# EAGLE design Sensor_Platform+GPIO_3v_boost_v2_1 (EAGLE 7.4.0)
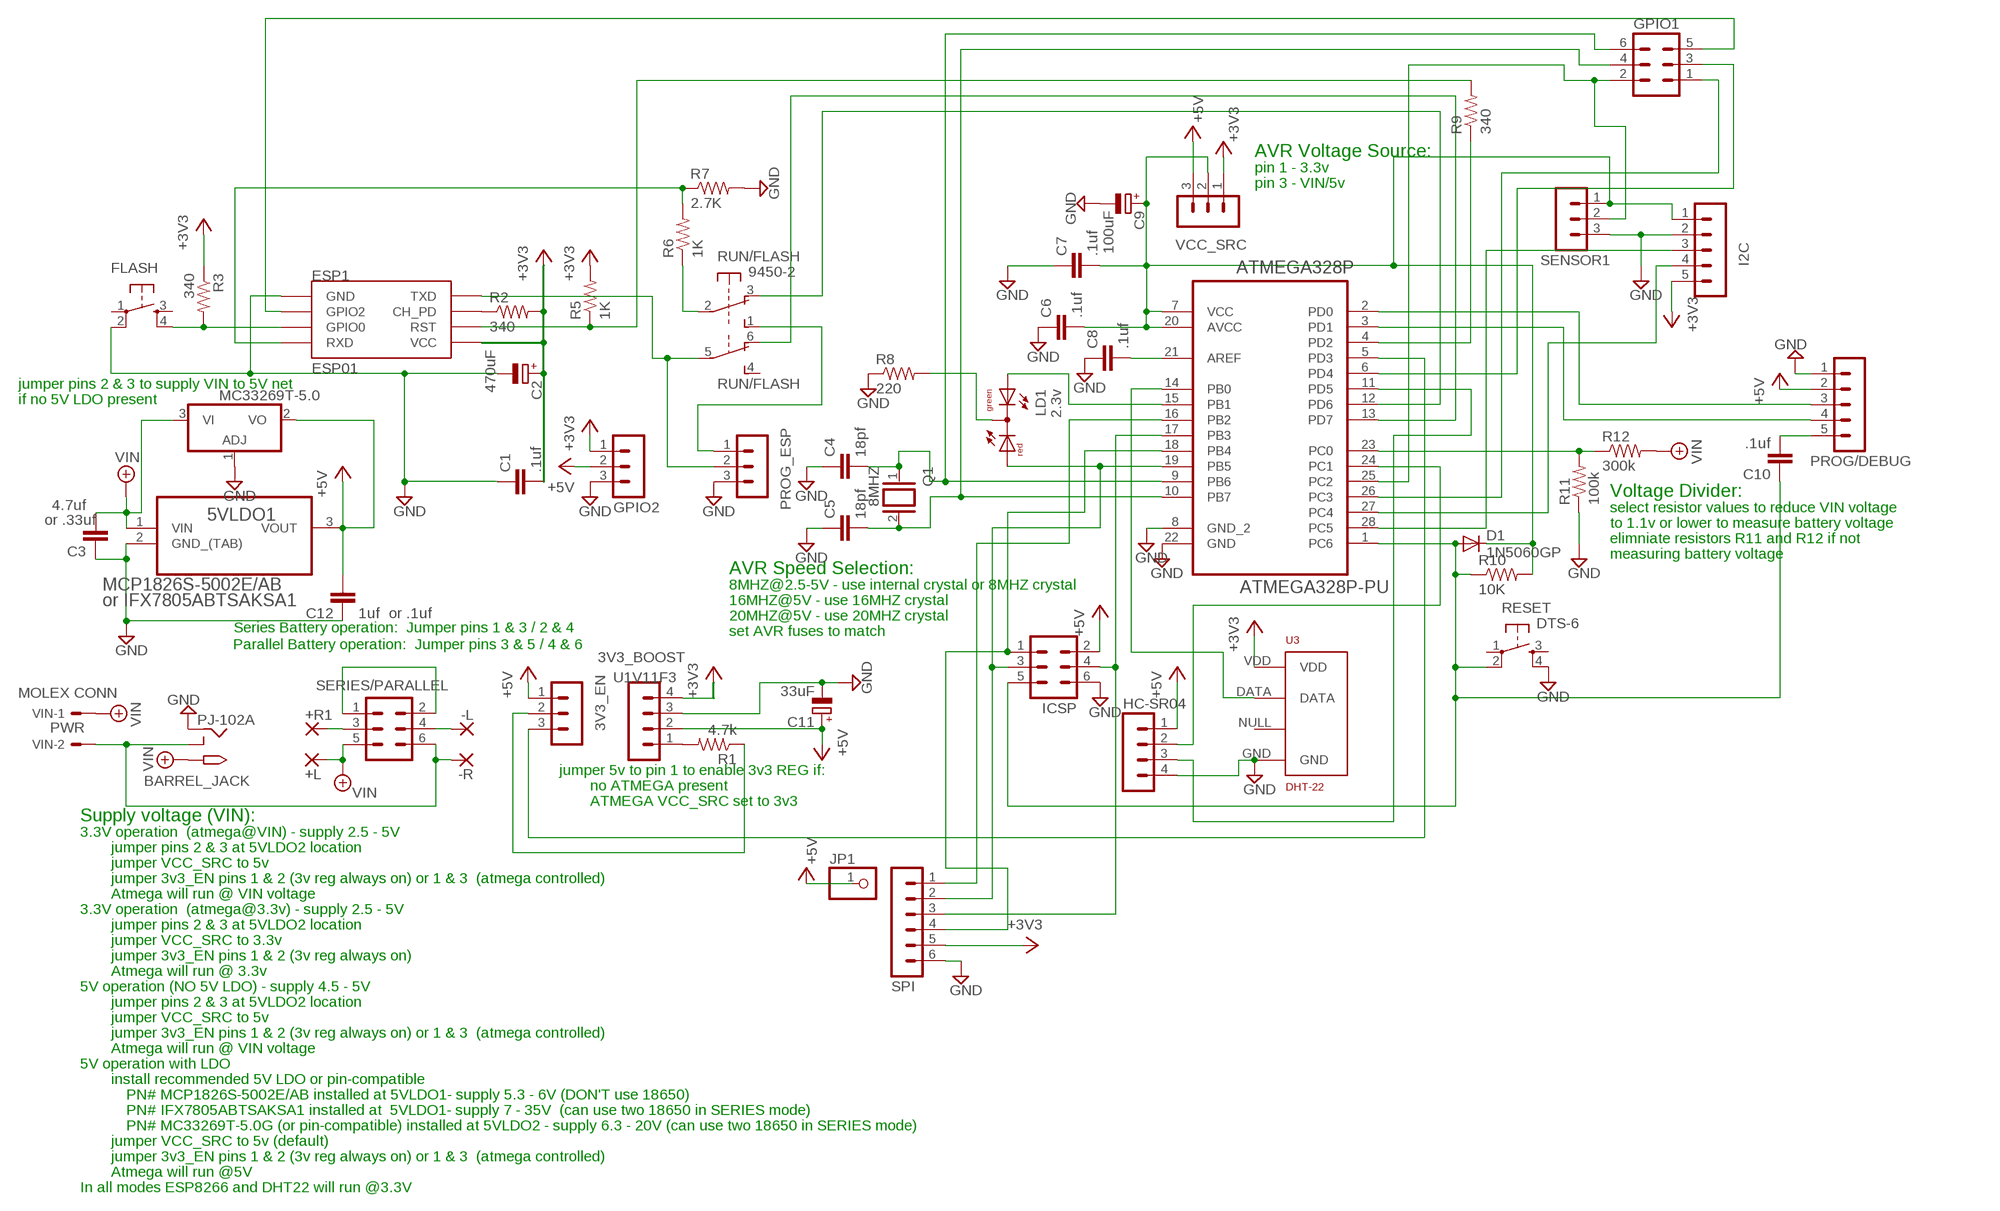
[diagram p0: schematic, sheet 1]

## Parts
3V3_BOOST  U1V11F3  MA04-1  [MA04-1]
3V3_EN  MA03-1  [MA03-1]
5VLDO1  MCP1826S-5002E/AB  [TO254P482X1024X3124-3P]
5VLDO2  MC33269T-5.0  [TO220V]
+L  WIREPADSMD2,54-5,08  [SMD2,54-5,08]
+R1  WIREPADSMD2,54-5,08  [SMD2,54-5,08]
-L  WIREPADSMD2,54-5,08  [SMD2,54-5,08]
-R  WIREPADSMD2,54-5,08  [SMD2,54-5,08]
ATMEGA328P  ATMEGA328P-PU  [DIP254P762X457-28]
BARREL_JACK  2.1MMJACKTHM  [PJ-102A]
C1  .1uf  C2.5/2  [C2.5-2]
C2  470uF  CPOL-EUE2,5-6E  [E2,5-6E]
C3  4.7uf  C2.5/2  [C2.5-2]
C4  18pf  C2.5/2  [C2.5-2]
C5  18pf  C2.5/2  [C2.5-2]
C6  .1uf  C2.5/2  [C2.5-2]
C7  .1uf  C2.5/2  [C2.5-2]
C8  .1uf  C2.5/2  [C2.5-2]
C9  100uF  CPOL-EUE2,5-6E  [E2,5-6E]
C10  .1uf  C2.5/2  [C2.5-2]
C11  33uF  CPOL-EUE2,5-6E  [E2,5-6E]
C12  1uf  C2.5/2  [C2.5-2]
D1  1N5060GP  [DO15-12]
ESP1  ESP01  [ESP01]
FLASH  DTS-6  [DTS-6]
GPIO1  MA03-2  [MA03-2]
GPIO2  MA03-1  [MA03-1]
HC-SR04  HC-SR04  MA04-1  [MA04-1]
I2C  MA05-1  [MA05-1]
ICSP  MA03-2  [MA03-2]
JP1  PINHD-1X1  [1X01]
LD1  2.3v  DUOLED-RG-C  [DUOLED-C-5MM]
PROG/DEBUG  MA05-1  [MA05-1]
PROG_ESP  MA03-1  [MA03-1]
Q1  8MHZ  XTAL/S  [QS]
R1  4.7k  R-US_0207/7  [0207/7]
R2  340  R-US_0207/7  [0207/7]
R3  340  R-US_0207/7  [0207/7]
R5  1K  R-US_0207/7  [0207/7]
R6  1K  R-US_0207/7  [0207/7]
R7  2.7K  R-US_0207/7  [0207/7]
R8  220  R-US_0207/7  [0207/7]
R9  340  R-US_0207/7  [0207/7]
R10  10K  R-US_0207/7  [0207/7]
R11  100k  R-US_0207/7  [0207/7]
R12  300k  R-US_0207/7  [0207/7]
RESET  DTS-6  [DTS-6]
RUN/FLASH  9450-2  [9450-2]
SENSOR1  MA03-1  [MA03-1]
SERIES/PARALLEL  MA03-2  [MA03-2]
SPI  MA06-1  [MA06-1]
U3  DHT-22  RHT03_DHT-22_AM2302  [RHT03_DHT-22]
VCC_SRC  MA03-1  [MA03-1]
VIN  PWR  22-27-2021-02  [6410-02]

## Nets
+3V3: 3V3_BOOST.4 C1.2 C2.+ ESP1.VCC GPIO2.1 I2C.5 R2.2 R3.1 R5.2 SPI.5 U3.VDD VCC_SRC.1
+4.1V: 5VLDO1.1(VIN) 5VLDO2.3(VI) +L.1(P) BARREL_JACK.TIP C3.2 R12.2 SERIES/PARALLEL.5 VIN.1 ; supply symbol labelled VIN
+5V: 3V3_BOOST.2 3V3_EN.1 5VLDO1.3(VOUT) 5VLDO2.2(VO) C11.+ C12.2 GPIO2.2 HC-SR04.1 ICSP.2 JP1.1 PROG/DEBUG.2 VCC_SRC.3
GND: 3V3_BOOST.3 5VLDO1.2(GND_(TAB)) 5VLDO2.1(ADJ) ATMEGA328P.8(GND_2) ATMEGA328P.22(GND) BARREL_JACK.RING C1.1 C2.- C3.1 C4.1 C5.1 C6.1 C7.1 C8.1 C9.- C11.- C12.1 ESP1.GND FLASH.2 GPIO2.3 HC-SR04.4 I2C.2 ICSP.6 PROG/DEBUG.1 PROG_ESP.3 R7.2 R8.1 R11.1 RESET.4 SENSOR1.3 SPI.6 U3.GND
N$1: ATMEGA328P.23(PC0) R11.2 R12.1
N$3: ESP1.GPIO0 FLASH.4 R3.2
N$4: ATMEGA328P.26(PC3) GPIO1.1
N$5: ESP1.RST R5.1 R9.2
N$6: ATMEGA328P.4(PD2) R9.1
N$7: 3V3_BOOST.1 R1.2
N$8: ESP1.GPIO2 GPIO1.5
N$9: ATMEGA328P.15(PB1) LD1.AX(AG)
N$10: ATMEGA328P.19(PB5) ICSP.3 LD1.AR SPI.2
N$11: ATMEGA328P.6(PD4) GPIO1.3
N$12: ATMEGA328P.7(VCC) ATMEGA328P.20(AVCC) C6.2 C7.2 C9.+ D1.C I2C.1 R10.2 SENSOR1.1 VCC_SRC.2
N$13: ATMEGA328P.12(PD6) RUN/FLASH.3(1:O)
N$14: ATMEGA328P.13(PD7) RUN/FLASH.6(2:O)
N$15: ATMEGA328P.21(AREF) C8.2
N$16: ESP1.RX(RXD) R6.2 R7.1
N$17: ESP1.TX(TXD) PROG_ESP.2 RUN/FLASH.5(2:P)
N$18: ATMEGA328P.2(PD0) PROG/DEBUG.3
N$19: ATMEGA328P.3(PD1) PROG/DEBUG.4
N$20: 3V3_EN.3 ATMEGA328P.5(PD3)
N$21: C10.2 PROG/DEBUG.5
N$22: ESP1.CH_PD R2.1
N$23: ATMEGA328P.17(PB3) ICSP.4 SPI.3
N$24: ATMEGA328P.14(PB0) U3.DATA
N$25: ATMEGA328P.18(PB4) ICSP.1 SPI.4
N$26: ATMEGA328P.9(PB6) C4.2 GPIO1.6 Q1.1
N$27: ATMEGA328P.10(PB7) C5.2 GPIO1.4 Q1.2
N$28: R6.1 RUN/FLASH.2(1:P)
N$29: ATMEGA328P.1(PC6) C10.1 D1.A ICSP.5 R10.1 RESET.2
N$30: LD1.C R8.2
N$31: 3V3_EN.2 R1.1
N$32: ATMEGA328P.28(PC5) I2C.3
N$33: PROG_ESP.1 RUN/FLASH.1(1:S)
N$34: ATMEGA328P.27(PC4) I2C.4
N$35: ATMEGA328P.25(PC2) GPIO1.2 SENSOR1.2
N$36: +R1.1(P) SERIES/PARALLEL.3
N$37: -R.1(P) BARREL_JACK.RING_SW SERIES/PARALLEL.6 VIN.2
N$38: -L.1(P) SERIES/PARALLEL.4
N$39: SERIES/PARALLEL.1 SERIES/PARALLEL.2
N$40: ATMEGA328P.11(PD5) HC-SR04.3
N$41: ATMEGA328P.24(PC1) HC-SR04.2
N$42: ATMEGA328P.16(PB2) SPI.1
Unconnected: FLASH.1 FLASH.3 RESET.1 RESET.3 RUN/FLASH.4(2:S) U3.NULL

## Notes on the sheet
- AVR Voltage Source:
- pin 1 - 3.3v
- pin 3 - VIN/5v
- jumper pins 2 & 3 to supply VIN to 5V net
- if no 5V LDO present
- Voltage Divider:
- select resistor values to reduce VIN voltage
- or .33uf | to 1.1v or lower to measure battery voltage
- elimniate resistors R11 and R12 if not
- measuring battery voltage
- AVR Speed Selection:
- 8MHZ@2.5-5V - use internal crystal or 8MHZ crystal
- or IFX7805ABTSAKSA1 | 16MHZ@5V - use 16MHZ crystal
- or .1uf | 20MHZ@5V - use 20MHZ crystal
- Series Battery operation:  Jumper pins 1 & 3 / 2 & 4 | set AVR fuses to match
- Parallel Battery operation:  Jumper pins 3 & 5 / 4 & 6
- MOLEX CONN
- PJ-102A
- jumper 5v to pin 1 to enable 3v3 REG if:
- no ATMEGA present
- ATMEGA VCC_SRC set to 3v3
- Supply voltage (VIN):
- 3.3V operation  (atmega@VIN) - supply 2.5 - 5V
- jumper pins 2 & 3 at 5VLDO2 location
- jumper VCC_SRC to 5v
- jumper 3v3_EN pins 1 & 2 (3v reg always on) or 1 & 3  (atmega controlled)
- Atmega will run @ VIN voltage
- 3.3V operation  (atmega@3.3v) - supply 2.5 - 5V
- jumper pins 2 & 3 at 5VLDO2 location
- jumper VCC_SRC to 3.3v
- jumper 3v3_EN pins 1 & 2 (3v reg always on)
- Atmega will run @ 3.3v
- 5V operation (NO 5V LDO) - supply 4.5 - 5V
- jumper pins 2 & 3 at 5VLDO2 location
- jumper VCC_SRC to 5v
- jumper 3v3_EN pins 1 & 2 (3v reg always on) or 1 & 3  (atmega controlled)
- Atmega will run @ VIN voltage
- 5V operation with LDO
- install recommended 5V LDO or pin-compatible
- PN# MCP1826S-5002E/AB installed at 5VLDO1- supply 5.3 - 6V (DON'T use 18650)
- PN# IFX7805ABTSAKSA1 installed at  5VLDO1- supply 7 - 35V  (can use two 18650 in SERIES mode)
- PN# MC33269T-5.0G (or pin-compatible) installed at 5VLDO2 - supply 6.3 - 20V (can use two 18650 in SERIES mode)
- jumper VCC_SRC to 5v (default)
- jumper 3v3_EN pins 1 & 2 (3v reg always on) or 1 & 3  (atmega controlled)
- Atmega will run @5V
- In all modes ESP8266 and DHT22 will run @3.3V

## Library data of the parts
3V3_BOOST HC-SR04 = con-lstb:MA04-1: PIN HEADER; OC_FARNELL: unknown; OC_NEWARK: unknown
3V3_EN GPIO2 PROG_ESP SENSOR1 VCC_SRC = con-lstb:MA03-1: PIN HEADER; OC_FARNELL: unknown; OC_NEWARK: unknown
5VLDO1 = Microchip_By_element14_Batch_1:MCP1826S-5002E/AB: IC, LDO, 5.0V, 1A; MPN: MCP1826S-5002E/AB; OC_FARNELL: 1578425; OC_NEWARK: 08N6494; PACKAGE: TO-220-3; SUPPLIER: Microchip
5VLDO2 = linear:MC33269?*: Adjustable Output Low Dropout Voltage Regulator 800 mA Source: http://www.onsemi.com/pub/Collateral/MC33269-D.PDF
+L +R1 -L -R = wirepad:WIREPAD: Wire PAD connect wire on PCB
ATMEGA328P = Atmel_By_element14_Batch_1-00:ATMEGA328P-PU: 8-bit Microcontroller with In-System Programmable Flash; MPN: ATMEGA328P-PU; OC_FARNELL: 1715487; OC_NEWARK: 15R0268; PACKAGE: PDIP-28; SUPPLIER: Atmel
BARREL_JACK = adafruit:2.1MMJACK: 2.1mm x 5.5mm THM DC jack with internal switch. Digikey part #PJ-102A, 4UCON part #05537 2.1mm x 5.5mm SMT DC jack with internal switch. Digikey part #PJ-002A-SMT, 4UCON part #03267 By microbuilder.eu & adafruit.com
C1 C3-C8 C10 C12 = capacitor-wima:C: CAPACITOR naming: grid - package width
C2 C9 C11 = rcl:CPOL-EU: POLARIZED CAPACITOR, European symbol
D1 = diode:1N5060GP: DIODE controlled avalanche rectifier
ESP1 = esp8266modules:ESP01: ESP8266 Wifi module 01
FLASH RESET = switch-tact:DTS-6
GPIO1 ICSP SERIES/PARALLEL = con-lstb:MA03-2: PIN HEADER; OC_FARNELL: unknown; OC_NEWARK: unknown
I2C PROG/DEBUG = con-lstb:MA05-1: PIN HEADER; OC_FARNELL: unknown; OC_NEWARK: unknown
JP1 = pinhead:PINHD-1X1: PIN HEADER
LD1 = led:DUOLED-RG-C: DUO LED 2 colors (red/green), 5 mm, round, common Cathode www.ligitek.com or other producers.
Q1 = special:XTAL/S: CRYSTAL
R1-R3 R5-R12 = rcl:R-US_: RESISTOR, American symbol
RUN/FLASH = switch-misc:9450-2: MARQUARDT SWITCH
SPI = con-lstb:MA06-1: PIN HEADER; OC_FARNELL: unknown; OC_NEWARK: unknown
U3 = RHT03_DHT-22_AM2302:RHT03_DHT-22_AM2302: RHT03 / DHT-22 / AM2302 Packages and symbol for the RHT03 / DHT-22 relative humidity and temperature sensor. Note: The AM2302 is a wired version of the DHT-22 which typically requires less clearance and is thus provided as a separate package.; PROD_ID: SEN-10167
VIN = con-molex:22-?-02: CONNECTOR wire to board 2.54 mm (.1 inch) pitch header; OC_FARNELL: unknown; OC_NEWARK: unknown

## Net classes
0 default: width 0.152 mm, drill 0.305 mm, clearance 0.152 mm
1 GND: width 0.305 mm, drill 0.305 mm, clearance 0.152 mm
2 +4.1V: width 0.305 mm, drill 0.305 mm, clearance 0.152 mm
3 +5V: width 0.305 mm, drill 0.305 mm, clearance 0.152 mm
4 +3V3: width 0.305 mm, drill 0.305 mm, clearance 0.152 mm

## Board
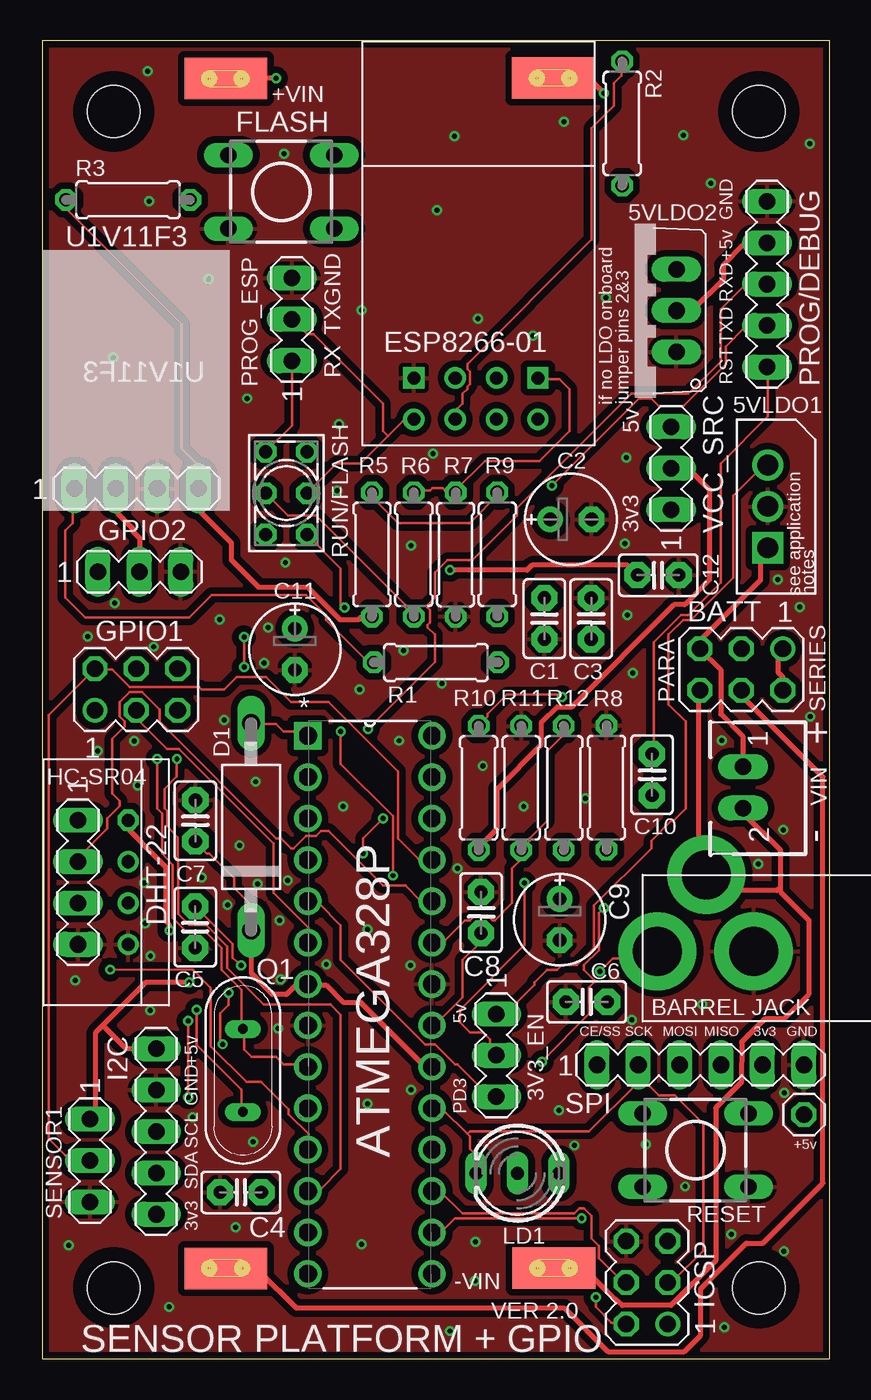
[diagram p1: board, top side]
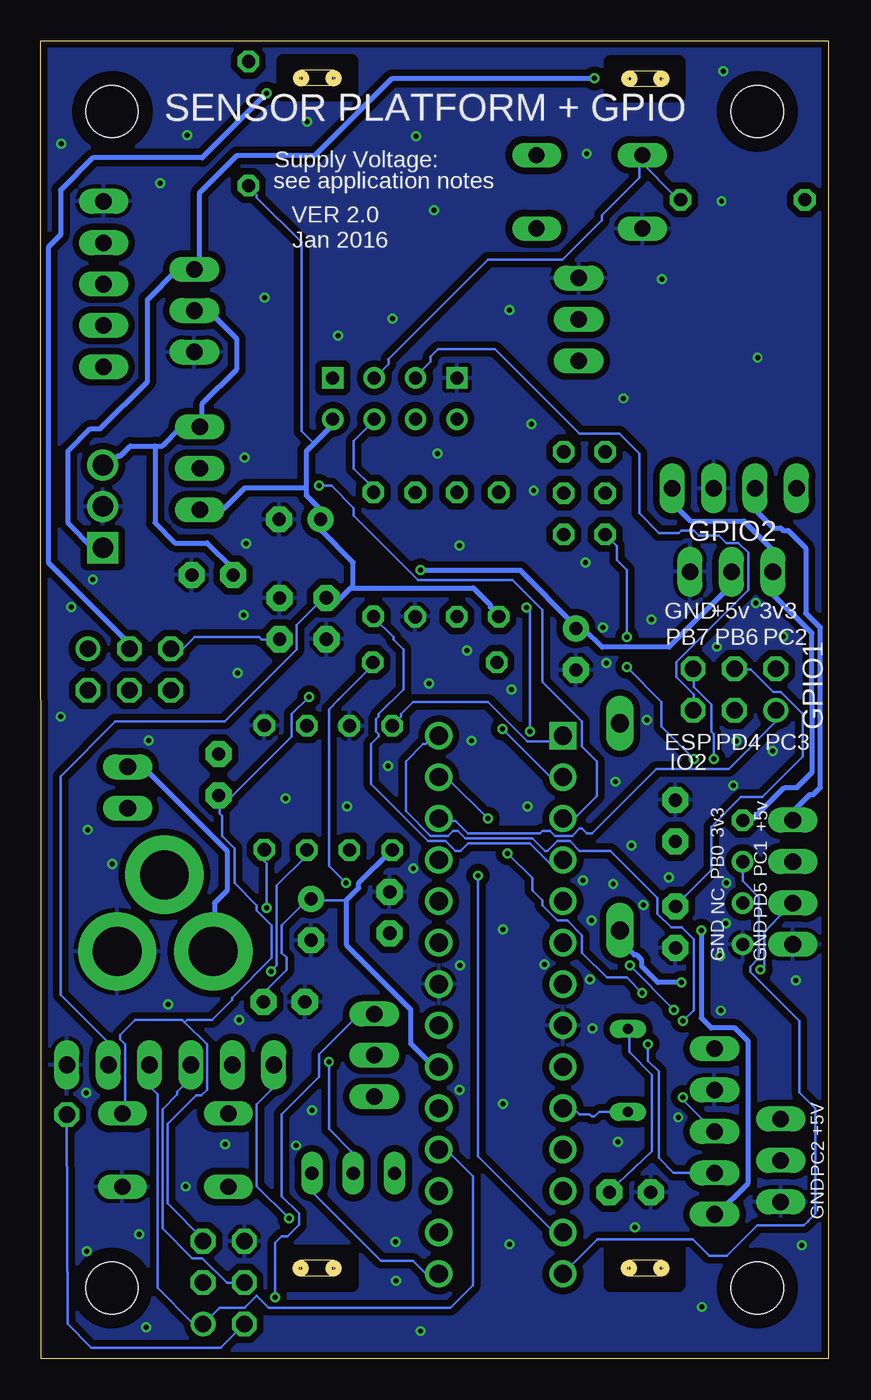
[diagram p2: board, bottom side, seen from below]

Size 48.34 x 80.87 mm. Coordinates in mm from the lower left corner, seen from the top.
Outline: 0,0 48.31,0 48.34,80.87 0,80.87 0,0
Copper layers (1*16): Top 0.035mm / dielectric 1.5mm / Bottom 0.035mm
Design rules "SeeedStudio_2layer_DRU_no_angle_20140221": minimum track width 6mil, minimum drill 12mil, track to track 6mil, track to pad 6mil, pad to pad 6mil, via to via 6mil, smd to smd 0mil, copper to edge 10mil, drill to drill 10mil, minimum pad ring 10mil, minimum via ring 6mil, stop-mask expansion 2mil, vias tented up to drill 100mil, thermal gap 10mil
Holes 3.2 mm at 43.97,4.34 4.37,76.53 43.97,76.53 4.37,4.34
tRestrict: area 2.5,74.7 to 6.2,78.4; area 42.1,74.7 to 45.8,78.4; area 42.1,2.5 to 45.8,6.2; area 2.5,2.5 to 6.2,6.2
bRestrict: area 2.5,74.7 to 6.2,78.4; area 42.1,74.7 to 45.8,78.4; area 29.3,77.6 to 33.5,79.7; area 42.1,2.5 to 45.8,6.2; area 2.5,2.5 to 6.2,6.2; area 9.2,77.5 to 13.4,79.6; area 9.2,4.5 to 13.4,6.6; area 29.2,4.5 to 33.5,6.6
Milling: area 10.2,5.1 to 12.2,6.1; area 30.4,5.1 to 32.4,6.1; area 30.4,78.1 to 32.4,79.1; area 10.2,78 to 12.2,79; area 9.9,78.2 to 10.5,78.8; area 11.9,78.2 to 12.5,78.8; area 30.1,78.3 to 30.6,78.9; area 32.1,78.3 to 32.6,78.9; area 32.1,5.3 to 32.7,5.8; area 30.1,5.3 to 30.7,5.8; area 9.9,5.3 to 10.5,5.8; area 12,5.3 to 12.5,5.8

### Footprints (pad centres in the part's own frame; a part is rotated, then mirrored left to right if it is on the bottom)
MA04-1 = drill 1.016 long: 1 -3.81,0; 2 -1.27,0; 3 1.27,0; 4 3.81,0
MA03-1 = drill 1.016 long: 1 -2.54,0; 2 0,0; 3 2.54,0
TO254P482X1024X3124-3P = drill 1.27 square: 1 -5.08,0.991 | drill 1.27: 2 -2.54,0.991; 3 0,0.991
TO220V = drill 1.016 long: 1 -2.54,-2.54; 2 0,-2.54; 3 2.54,-2.54
SMD2,54-5,08 = smd 2.54 x 5.08: 1 0,0
DIP254P762X457-28 = drill 1.118 square: 1 -7.62,33.02 | drill 1.118: 2 -7.62,30.48; 3 -7.62,27.94; 4 -7.62,25.4; 5 -7.62,22.86; 6 -7.62,20.32; 7 -7.62,17.78; 8 -7.62,15.24; 9 -7.62,12.7; 10 -7.62,10.16; 11 -7.62,7.62; 12 -7.62,5.08; 13 -7.62,2.54; 14 -7.62,0; 15 0,0; 16 0,2.54; 17 0,5.08; 18 0,7.62; 19 0,10.16; 20 0,12.7; 21 0,15.24; 22 0,17.78; 23 0,20.32; 24 0,22.86; 25 0,25.4; 26 0,27.94; 27 0,30.48; 28 0,33.02
PJ-102A = drill 3 pad 4.8: RING 0.1,-3.39; RING_SW -4.6,-6.29; TIP 0.1,-9.29
C2.5-2 = drill 0.813 pad 1.6 octagon: 1 -1.27,0; 2 1.27,0
E2,5-6E = drill 0.813 pad 1.575: + -1.27,0 | drill 0.813 pad 1.575 octagon: - 1.27,0
DO15-12 = drill 1.118 long: A 6.35,0; C -6.35,0
ESP01 = drill 0.8: CH_PD -1.285,-8.178; GPIO0 1.255,-5.638; GPIO2 -1.285,-5.638; RST 1.255,-8.178; TX -3.825,-8.178; VCC 3.795,-8.178 | drill 0.8 square: GND -3.825,-5.638; RX 3.795,-5.638
DTS-6 = drill 1 long: 1 -3.25,2.25; 2 3.25,2.25; 3 -3.25,-2.25; 4 3.25,-2.25
MA03-2 = drill 1.016: 1 -2.54,-1.27 | drill 1.016 octagon: 2 -2.54,1.27; 3 0,-1.27; 4 0,1.27; 5 2.54,-1.27; 6 2.54,1.27
MA05-1 = drill 1.016 long: 1 -5.08,0; 2 -2.54,0; 3 0,0; 4 2.54,0; 5 5.08,0
1X01 = drill 1.016 octagon: 1 0,0
DUOLED-C-5MM = drill 0.813 long: AR 2.54,0; AX -2.54,0; C 0,0
QS = drill 0.61 long: 1 -2.54,0; 2 2.54,0
0207/7 = drill 0.813 octagon: 1 -3.81,0; 2 3.81,0
9450-2 = drill 0.813 octagon: 1 -2.54,-1.27; 2 0,-1.27; 3 2.54,-1.27; 4 -2.54,1.27; 5 0,1.27; 6 2.54,1.27
MA06-1 = drill 1.016 long: 1 -6.35,0; 2 -3.81,0; 3 -1.27,0; 4 1.27,0; 5 3.81,0; 6 6.35,0
RHT03_DHT-22 = drill 0.8: DATA -1.27,0; GND 3.81,0; NULL 1.27,0 | drill 0.8 octagon: VDD -3.81,0
6410-02 = drill 1.016 long: 1 1.27,0.914; 2 -1.27,0.914

### Placement (x,y rotation side)
3V3_BOOST  5.77,53.41 0 top
3V3_EN  27.86,18.62 270 top
5VLDO1  45.52,54.84 90 top
5VLDO2  36.37,64.31 90 top
+L  11.26,78.57 270 top
+R1  31.34,78.59 90 top
-L  11.25,5.54 90 top
-R  31.39,5.56 90 top
ATMEGA328P  23.91,5.21 0 top
BARREL_JACK  47.04,25.1 270 top
C1  30.81,45.42 90 top
C2  32.44,51.5 0 top
C3  33.68,45.42 270 top
C4  12.17,10.21 0 top
C5  9.38,26.48 90 top
C6  33.4,21.89 0 top
C7  9.39,33.01 270 top
C8  26.92,27.38 270 top
C9  31.75,26.95 270 top
C10  37.41,35.84 90 top
C11  15.49,43.54 270 top
C12  37.79,48.08 180 top
D1  12.8,32.64 90 top
ESP1  26.62,65.82 0 top
FLASH  14.66,71.61 180 top
GPIO1  5.76,41.06 0 top
GPIO2  5.95,48.29 0 top
HC-SR04  2.18,29.24 270 top
I2C  6.98,13.94 270 top
ICSP  37.11,4.67 90 top
JP1  46.73,14.99 0 top
LD1  29.16,11.38 180 top
PROG/DEBUG  44.48,65.94 270 top
PROG_ESP  15.32,63.78 90 top
Q1  12.3,17.69 270 top
R1  24.15,42.72 180 top
R2  35.58,75.79 270 top
R3  5.26,71.12 0 top
R5  20.23,49.35 270 top
R6  22.8,49.35 90 top
R7  25.35,49.34 270 top
R8  34.62,35.05 270 top
R9  27.92,49.36 90 top
R10  26.77,35.03 270 top
R11  29.39,35.03 270 top
R12  32,35.03 270 top
RESET  40.08,12.8 0 top
RUN/FLASH  14.97,53.12 270 top
SENSOR1  2.92,12.17 270 top
SERIES/PARALLEL  42.9,42.29 180 top
SPI  40.39,18.03 0 top
U3  5.26,29.23 270 top
VCC_SRC  38.58,54.64 90 top
VIN  43.92,35.05 90 top

### Tracks (layer width: path | path; a pad name or v marks a point on that pad's centre or on a via)
+3V3  (via drill 0.3)
  Top 0.152: R3.1 1.55,71.09 1.55,70.49 8.56,63.47 8.56,55.85 9.47,54.94 9.47,53.42 3V3_BOOST.4 9.63,53.26 | 20.14,45.49 R5.2
  Top 0.305: v7.8,26.29 7.8,26.59 7.59,26.82 7.59,30.15 6.88,30.86 5.36,32.41 5.36,32.94 U3.VDD | 9.63,53.26 9.63,52.04 11.61,50.06 11.61,49 13.26,47.35 16.28,47.35 18.29,45.34 19.38,45.34 19.53,45.49 20.14,45.49
  Bottom 0.152: 3.38,48.23 GPIO2.1 3.53,48.39 | 9.47,53.26 3V3_BOOST.4 | 30.5,57.23 30.5,57.53 ESP1.VCC | 31.27,51.59 C2.+ 31.11,51.44 | 31.57,56.16 32.33,56.92 32.33,68.5 35.08,71.25 35.08,71.4 35.53,71.86 R2.2 | 38.58,52.2 VCC_SRC.1 | 30.66,46.56 C1.2 30.81,46.56 31.11,46.56 32.64,45.03 32.64,43.51 37.06,39.09 43.76,39.09 47.12,35.74 47.12,22.33 44.22,19.43 44.22,18.06 SPI.5
  Bottom 0.305: 3.38,48.23 3.38,46.86 1.02,44.53 0.99,35.99 1.93,35.05 2.69,35.05 4.6,33.15 5.21,33.15 U3.VDD | v7.8,26.29 7.8,20.9 7.19,20.29 5.74,20.29 4.93,19.48 4.93,10.77 6.83,8.86 | 9.47,52.5 9.47,53.26 | 3.53,48.39 3.53,49.76 5.18,51.41 8.46,51.41 9.47,52.43 | 30.5,57.23 31.57,56.16 32.03,55.7 32.03,53.42 | 32.03,53.42 32.03,52.96 31.27,52.2 31.27,51.59 | 38.58,52.2 37.06,52.2 35.84,53.42 32.03,53.42 | 29.16,47.29 29.31,47.29 30.05,46.56 30.66,46.56 | 29.16,47.29 21.79,47.29 20.75,46.25 20.75,46.1 20.29,45.64 R5.2 | 31.11,51.44 31.11,50.83 29.16,48.87 29.16,47.29
  Bottom 0.406: 9.47,52.5 9.47,52.43 | I2C.5 6.83,8.86
+4.1V  (via drill 0.3)
  Top 0.152: v34.21,23.77 35,24.56 37.32,24.56 BARREL_JACK.TIP | 40.41,43.66 SERIES/PARALLEL.5 | 11.3,78.56 +L.1
  Top 0.305: 40.41,43.66 40.41,44.12 44.07,47.78 44.07,49.3 5VLDO1.1 | VIN.1 43,38.18 41.63,39.55 41.63,42.29 SERIES/PARALLEL.5 | v14.35,78.56 11.3,78.56
  Bottom 0.152: v34.21,23.77 33.86,24.13 33.86,29.03 32.03,30.86 32.03,31.17 R12.2 | 39.04,66.83 5VLDO2.3 38.89,66.98 38.58,67.28 | C3.2 33.7,44.12 34.77,44.12 34.92,44.27 38.89,44.27 39.65,43.51 40.26,43.51 SERIES/PARALLEL.5 | 43,36.2 VIN.1 | 37.67,25.08 BARREL_JACK.TIP
  Bottom 0.305: 39.04,66.83 39.95,66.83 41.78,65 41.78,59.97 44.68,57.07 45.29,57.07 46.66,55.7 46.66,51.28 45.13,49.76 5VLDO1.1 | 38.58,67.28 38.58,71.55 36.3,73.84 31.5,73.84 26.77,78.56 v14.35,78.56 | 37.67,25.08 37.67,27.97 36.91,28.73 36.91,31.17 38.73,32.99 41.93,36.2 43,36.2
+5V  (via drill 0.3)
  Top 0.152: 4.6,51.89 4.6,53.26 3V3_BOOST.2 | 5.97,48.39 GPIO2.2 | v33.96,3.76 33.96,3.18 34.92,2.21 35.84,2.21 ICSP.2 | 39.04,64.39 5VLDO2.2 | 44.37,68.35 PROG/DEBUG.2 | 5VLDO1.3 44.53,54.79 44.22,54.79 42.39,52.96 42.39,47.93 39.8,45.34 39.34,45.34 38.43,44.42 38.43,40.16 39.5,39.09 39.5,33.76 38.73,32.99 38.58,32.99 37.36,31.78 37.36,31.32 33.86,27.81 33.86,25.22 32.79,24.16 31.88,24.16 31.57,23.85 30.96,23.85 30.2,23.09 30.2,22.94 29.03,21.77 28.47,21.77 3V3_EN.1 | 36.45,48.08 C12.2
  Top 0.305: 5.97,48.39 5.97,50.37 5.51,50.83 5.51,50.98 4.6,51.89 | 39.04,64.39 39.95,64.39 41.78,66.22 41.78,67.13 43,68.35 44.37,68.35 | v25.02,48.39 29.74,48.39 30.05,48.69 35.91,48.69 C12.2
  Bottom 0.152: 2.16,33.15 HC-SR04.1 | 4.44,53.26 3V3_BOOST.2 | 15.42,44.73 C11.+ 15.57,44.88 | 5.97,48.23 GPIO2.2 | 38.58,57.07 VCC_SRC.3 38.58,57.23 38.43,57.38 | 44.53,54.94 5VLDO1.3 | 36.6,48.08 C12.2 | JP1.1 46.68,2.13 45.24,0.69 37.29,0.69 ICSP.2 | v33.96,3.76 33.96,7.11 33.55,7.52 33.2,7.52 32.49,8.23 32.49,8.92 33.55,9.98 33.55,15.01 31.27,17.3 31.27,18.67 28.98,20.96 28.85,20.96 28.26,21.55 3V3_EN.1
  Bottom 0.305: 4.44,53.26 4.44,52.04 3.38,50.98 2.92,50.98 2.77,50.83 2.46,50.83 1.4,49.76 1.4,45.75 0.48,44.88 0.48,35.05 0.91,34.62 1.14,34.62 2.16,33.6 2.16,33.15 | 15.42,44.73 14.96,44.73 13.89,43.66 9.78,43.66 5.97,47.47 5.97,48.23 | 38.58,57.07 39.8,57.07 40.87,56.01 41.32,56.01 | 41.32,56.01 42.85,56.01 43.46,55.4 43.61,55.4 44.07,54.94 44.53,54.94 | 36.6,48.08 36.6,48.54 38.12,50.06 40.11,50.06 41.32,51.28 41.32,56.01 | 38.43,57.38 38.43,58.6 36.3,60.73 36.3,62.56 37.97,64.24 38.89,64.24 5VLDO2.2 | v25.02,48.39 18.92,48.39 15.57,45.03 15.57,44.88
GND  (via drill 0.3)
  other vias: 9.78,29.54 17.42,24.21 19.96,15.65 2.01,23.22 7.77,3.17 41.86,1.93 45.52,6.6 19.58,7.01 45.47,32.46 32.66,13.08 26.57,7.19 26.54,4.78 25.02,1.7 37.03,13.16 31.7,15.24 22.63,16.51 22.61,24.13 33.32,34.37 27.02,36.37 41.71,37.95 24.51,41.43 19.46,41.07 36.24,42.09 46.48,46.13 35.89,45.64 22.63,49.91 2.77,44.32 23.98,55.55 35.84,55.3 35.74,50.01 45.13,47.8 18.46,33.88 21.89,37.92 13.61,42.7 11.15,39.19 13.84,44.86 14.55,26.9 15.06,29.36 14.48,20.27 19.96,26.34 12.93,13.31 11.86,8.08 1.62,6.96 36.17,20.8 25.48,30.1 29.54,33.88 10.87,45.36 24.21,70.48 19.58,64.34 30.1,62.79 34.59,65.1 41.02,72.14 39.34,75.08 47.09,74.55 25.3,75.01 14.83,73.94 6.55,71.02 4.34,61.44 10.21,66.24 6.45,78.99 6.6,21.36 18.21,57.35 32,75.9 3.4,37.29 5.84,35.18 5.64,37.9 6.83,43.69 4.44,46.38 13.21,29.13 22.17,43.46 14.63,23.27 12.09,31.5 47.12,39.4 9.22,14.81 6.3,26.72 11.35,27.84 6.25,29.18 6.63,24.71 13.08,35.41 40.51,21.74 43.94,30.35 45.54,16.31 39.45,10.57 42.29,7.65 14.91,48.84 12.57,58.93 18.08,53.26 26.75,63.83
  pour Top (isolate 0.406): -0.1,-0.18 -0.13,80.98 48.41,80.98 48.47,-0.13
  pour Bottom (isolate 0.406): -0.1,-0.15 -0.13,80.98 48.39,80.98 48.47,-0.13
N$1
  Top 0.152: R12.1 31.88,38.79 31.88,38.18 30.96,37.26 30.96,32.99 29.89,31.93 29.89,31.78 29.44,31.32 R11.2 29.29,31.17 29.29,30.56 28.83,30.1 28.83,27.97 27.76,26.9 27.61,26.9 27.3,27.2 26.54,27.2 26.24,26.9 25.93,26.9 24.71,25.68 23.95,25.68 ATMEGA328P.23
N$3
  Bottom 0.152: 11.61,73.53 11.61,73.69 11.45,73.84 FLASH.4 11.61,73.53 | 11.61,73.53 11.61,72.47 13.89,70.18 13.89,69.88 16.33,67.44 20.9,67.44 27,61.34 27,61.04 27.76,60.27 ESP1.GPIO0 | 11.61,73.53 9.32,71.25 9.17,71.25 R3.2
N$4
  Bottom 0.152: GPIO1.1 3.22,39.7 3.22,39.09 6.12,36.2 10.54,36.2 14.5,32.23 14.81,32.23 15.11,32.54 15.26,32.54 15.72,32.08 16.79,32.08 17.09,32.39 17.55,32.39 17.7,32.23 22.12,32.23 22.88,32.99 23.65,32.99 23.8,33.15 ATMEGA328P.26
N$5
  Top 0.152: R5.1 20.29,53.11 20.29,52.81 21.82,51.28 26.24,51.28 28.07,53.11 R9.2
  Bottom 0.152: ESP1.RST 27.91,57.53 29.13,56.31 29.13,54.64 28.07,53.57 28.07,53.26 R9.2
N$6
  Bottom 0.152: R9.1 27.91,45.49 26.69,44.27 26.69,44.12 26.08,43.51 26.08,41.07 27.61,39.55 27.61,39.4 27.76,39.24 27.76,38.48 27.61,38.33 27.61,38.18 28.07,37.72 28.07,35.28 24.56,31.78 23.49,31.78 22.88,31.17 22.58,31.17 22.12,31.62 18.31,31.62 17.09,30.4 16.48,30.4 16.33,30.56 ATMEGA328P.4
N$7
  Top 0.152: R1.2 20.29,42.75 19.99,42.75 17.4,45.34 17.4,45.64 16.18,46.86 10.39,46.86 9.02,45.49 2.62,45.49 1.4,46.71 1.4,50.83 1.85,51.28 1.85,53.26 3V3_BOOST.1
N$8
  Bottom 0.152: ESP1.GPIO2 25.32,60.27 24.41,61.19 24.41,61.49 23.95,61.95 20.45,61.95 15.26,56.77 12.83,56.77 11.61,55.55 11.61,51.89 10.39,50.67 9.17,50.67 9.02,50.83 8.25,50.83 7.95,50.52 6.73,50.52 6.27,50.06 5.51,50.06 4.9,49.45 4.9,47.17 9.32,42.75 9.32,41.83 8.25,40.77 8.25,39.85 GPIO1.5
N$9
  Bottom 0.152: LD1.AX 31.57,11.35 31.57,10.13 27.46,6.02 25.48,6.02 24.71,5.26 23.95,5.26 ATMEGA328P.15
N$10
  Top 0.152: 26.08,13.79 24.56,15.32 23.95,15.32 ATMEGA328P.19 | 26.08,13.79 26.24,13.64 26.24,12.88 26.54,12.57 26.54,11.51 LD1.AR | ICSP.3 38.43,4.8 38.73,4.8 40.56,6.63 40.56,14.4 38.81,16.15 37.85,16.15 37.06,16.94 37.06,17.91 36.6,17.91 SPI.2 36.45,17.91 36.45,16.84 33.55,13.94 26.24,13.94 26.08,13.79
N$11
  Top 0.152: GPIO1.3 5.82,39.7 5.82,39.24 7.64,37.41 8.41,37.41 14.2,31.62 14.2,28.58 16.33,26.44 16.33,25.68 ATMEGA328P.6
N$12  (via drill 0.3)
  Top 0.152: 12.67,26.29 12.67,27.97 11.76,28.88 11.76,29.49 10.24,31.01 10.08,31.01 9.47,31.62 C7.2 | 12.83,26.29 D1.C | 23.8,18.06 ATMEGA328P.20 | 16.33,22.94 ATMEGA328P.7 | VCC_SRC.2 | 26.69,31.32 R10.2
  Top 0.305: 12.67,26.29 D1.C 12.83,26.26 12.83,23.65 14.12,22.35 14.99,22.35 15.62,22.99 ATMEGA328P.7 | 23.8,18.06 23.34,18.06 19.53,21.87 18.46,21.87 17.4,22.94 16.33,22.94 | VCC_SRC.2 39.65,54.64 40.94,53.34 40.94,47.8 39.42,46.28 38.76,46.28 32.49,40.01 31.6,40.01 30.61,39.01 30.61,37.67 27.91,34.98 27.91,32.54 26.69,31.32 | v9.02,23.09 6.35,23.09 3.71,20.45 | 3.71,20.45 3.25,19.99 3.25,15.04 SENSOR1.1 | I2C.1 5.13,19.02 3.71,20.45
  Bottom 0.152: 29.59,28.12 31.72,28.12 C9.+ 31.88,28.27 33.55,26.59 33.55,24.92 33.25,24.61 33.25,23.85 34.47,22.63 34.47,22.1 C6.2 | 25.63,21.41 25.63,21.26
  Bottom 0.305: R10.2 26.85,31.17 28.83,29.18 28.83,28.88 29.59,28.12 29.59,25.4 25.63,21.41 | ATMEGA328P.20 23.95,18.06 24.36,18.06 25.63,19.33 25.63,21.26 | v9.02,23.09 10.46,23.09 11.45,24.08 11.45,24.46 11.76,24.77 11.91,24.77 12.83,25.68
  Bottom 0.406: 12.83,25.68 12.83,26.26 D1.C
N$13  (via drill 0.3)
  Top 0.152: v12.37,42.44 v12.37,44.27 | v8.25,36.8 8.25,35.74 7.49,34.98 7.49,33.76 7.64,33.6 7.64,32.69 8.3,31.98 8.3,30.71 8.33,30.68 8.33,27.31 9.02,26.62 10.06,26.62 11.33,25.3 11.33,23.98 13.56,21.74 17.68,21.74 18.31,21.11 18.31,11.66 17.09,10.44 16.33,10.44 ATMEGA328P.12
  Bottom 0.152: v12.37,44.27 12.37,48.39 12.98,49 12.98,49.86 RUN/FLASH.3 | v12.37,42.44 10.24,40.31 10.24,38.79 v8.25,36.8
N$14  (via drill 0.3)
  Top 0.152: v18.54,46.1 18.31,46.25 18.31,48.5 RUN/FLASH.6 | v18.31,38.48 18.31,36.5 21.51,33.3 v21.51,29.64
  Bottom 0.152: v21.51,29.64 21.51,12.42 16.94,7.85 16.33,7.85 ATMEGA328P.13 | v18.31,38.48 18.31,45.95 v18.54,46.1
N$15
  Top 0.152: C8.2 26.85,25.98 26.85,25.53 25.78,24.46 25.78,22.17 23.95,20.35 ATMEGA328P.21
N$16
  Top 0.152: 25.32,53.26 27.15,55.09 30.5,55.09 32.33,56.92 32.33,59.51 31.72,60.12 30.5,60.12 ESP1.RX | 25.32,53.26 24.71,53.26 24.56,53.42 23.95,53.42 23.8,53.26 22.88,53.26 R6.2 | 25.32,53.26 R7.1
N$17
  Top 0.152: 21.21,56.62 19.53,54.94 18.06,54.94 RUN/FLASH.5 | 21.21,56.62 22.12,57.53 22.73,57.53 ESP1.TX | 21.21,56.62 20.9,56.92 20.9,58.6 16.64,62.87 16.23,62.87 PROG_ESP.2
N$18  (via drill 0.3)
  Top 0.152: v19.99,38.63 24.1,42.75 24.1,44.42 23.65,44.88 23.65,45.03 23.8,45.19 23.8,45.95 23.65,46.1 23.65,46.25 24.1,46.71 24.1,48.23 24.87,49 26.39,49 29.13,51.74 29.13,52.2 36.14,59.21 39.65,59.21 41.63,61.19 41.63,64.39 43.15,65.91 44.37,65.91 PROG/DEBUG.3
  Bottom 0.152: v19.99,38.63 17.09,35.74 16.33,35.74 ATMEGA328P.2
N$19  (via drill 0.3)
  Top 0.152: v31.27,53.57 36.6,58.9 37.36,58.9 37.82,58.45 39.34,58.45 41.93,61.04 41.93,62.1 43.15,63.32 44.37,63.32 PROG/DEBUG.4
  Bottom 0.152: v31.27,53.57 30.5,53.57 29.13,52.2 29.13,51.74 25.17,47.78 19.38,47.78 17.55,45.95 17.55,41.53 15.11,39.09 15.11,37.57 14.2,36.65 14.2,34.52 15.42,33.3 16.18,33.3 ATMEGA328P.3
N$20
  Top 0.152: 3V3_EN.3 27.46,16.08 25.48,18.06 25.32,18.06 24.1,19.28 23.49,19.28 18.31,24.46 18.31,26.59 16.94,27.97 16.33,27.97 ATMEGA328P.5
N$21
  Top 0.152: PROG/DEBUG.5 44.53,60.73 44.53,57.84 41.63,54.94 41.63,47.63 39.65,45.64 39.19,45.64 37.51,43.97 37.51,37.11 C10.2
N$22
  Top 0.152: ESP1.CH_PD 25.48,57.68 25.48,58.29 25.78,58.6 25.78,59.21 26.08,59.51 26.08,59.66 26.24,59.82 26.24,60.58 26.08,60.73 26.08,61.04 33.7,68.66 33.7,75.51 35.08,76.89 35.08,78.26 35.53,78.71 35.53,79.48 R2.1
N$23
  Top 0.152: ATMEGA328P.17 23.95,10.29 24.41,10.29 25.78,8.92 32.64,8.92 32.94,9.22 33.25,9.22 33.7,8.76 33.7,7.39 34.16,6.93 34.16,6.17 35.53,4.8 35.84,4.8 ICSP.4
  Bottom 0.152: ICSP.4 35.84,4.65 36.91,4.65 38.43,6.17 39.04,6.17 40.87,8 40.87,15.32 39.95,16.23 39.95,16.38 39.19,17.15 39.19,17.91 SPI.3
N$24
  Bottom 0.152: U3.DATA 5.26,29.31 4.27,28.32 4.27,24.59 4.8,24.05 4.8,23.75 1.78,20.73 1.78,16.33 0.81,15.37 0.81,8.89 1.24,8.46 1.24,8.43 1.5,8.18 4.37,8.18 6.22,6.32 7.29,6.32 8.3,7.34 14.16,7.34 ATMEGA328P.14
N$25
  Bottom 0.152: SPI.4 41.63,17.91 41.63,16.69 41.17,16.23 41.17,4.34 39.04,2.21 38.43,2.21 ICSP.1 38.28,2.21 37.36,3.12 35.84,3.12 35.1,3.86 34.37,3.12 23.19,3.12 21.82,4.5 21.82,11.2 23.34,12.73 23.8,12.73 ATMEGA328P.18
N$26  (via drill 0.3)
  Top 0.152: ATMEGA328P.9 16.18,18.06 14.81,18.06 14.35,18.52 12.83,18.52 12.37,18.97 12.37,20.19 Q1.1 12.22,20.35 12.22,22.63 11,23.85 11,25.2 9.96,26.26 8.79,26.26 8,27.05 8,30.3 7.34,31.01 7.34,33.45 7.03,33.76 v7.03,36.8
  Bottom 0.152: v7.03,36.8 7.03,38.33 7.19,38.48 7.19,40.16 8.25,41.22 8.25,42.29 GPIO1.6 | C4.2 13.44,10.29 10.82,12.73 10.82,17.42 12.22,18.82 12.22,20.19 Q1.1
N$27  (via drill 0.3)
  Top 0.152: Q1.2 12.22,15.16 12.22,16.51 9.47,19.25 v9.47,21.41 | v12.19,24.13 11.68,24.59 11.68,25.45 C5.2
  Bottom 0.152: Q1.2 12.37,15.16 14.05,15.16 14.35,14.86 14.5,14.86 14.65,15.01 15.26,15.01 15.57,15.32 16.18,15.32 ATMEGA328P.10 | GPIO1.4 5.66,42.29 4.75,42.29 3.38,40.92 2.92,40.92 1.57,39.57 1.57,36.96 4.06,34.47 5.36,34.47 7.19,32.64 7.19,30 8.79,28.4 C5.2 | v9.47,21.41 v12.19,24.13
N$28
  Top 0.152: R6.1 22.73,45.64 22.27,46.1 22.27,46.25 16.79,51.74 15.07,51.74 RUN/FLASH.2
N$29  (via drill 0.3)
  Top 0.152: D1.A 12.83,38.94 14.35,38.94 14.81,38.48 16.03,38.48 16.18,38.33 ATMEGA328P.1 | v31.88,40.61 31.72,40.77 28.52,40.77 27.3,39.55 27.3,39.4 26.85,38.94 R10.1
  Bottom 0.152: R10.1 26.69,38.94 26.24,39.4 26.24,39.55 25.48,40.31 20.9,40.31 18.46,37.87 16.64,37.87 16.33,38.18 ATMEGA328P.1 | 39.5,20.65 38.12,19.28 38.12,16.51 38.48,16.15 38.81,16.15 40.56,14.4 40.56,9.53 38.28,7.24 ICSP.5 | 39.5,20.65 39.65,20.8 42.54,20.8 43.46,19.89 43.46,19.58 43.15,19.28 43.15,16.84 43.15,15.23 RESET.2 | 37.36,34.52 37.36,33.45 37.21,33.3 37.21,32.08 36.45,31.32 36.45,29.18 35.08,27.81 35.08,27.51 34.16,26.59 34.16,24.59 36.6,22.15 36.6,22.02 37.82,20.8 39.34,20.8 39.5,20.65 | v31.88,40.61 32.94,39.55 32.94,38.18 36.6,34.52 37.36,34.52 | 37.36,34.52 C10.1
N$30  (via drill 0.3)
  Top 0.152: v34.47,27.66 34.16,27.36 34.16,25.07 33.25,24.16 33.25,23.85 33.86,23.24 33.86,23.09 33.55,22.78 33.55,21.16 30.66,18.26 v30.66,18.21
  Bottom 0.152: v30.66,18.21 30.66,14.1 29.29,12.73 29.29,11.51 LD1.C | v34.47,27.66 34.47,30.4 34.62,30.56 R8.2
N$31  (via drill 0.3)
  Top 0.152: v29.59,29.18 29.59,25.4 25.63,21.41 25.63,20.65 26.24,20.04 27,20.04 27.46,19.58 27.46,19.02 3V3_EN.2
  Bottom 0.152: R1.1 28.07,42.6 28.07,42.44 30.05,40.46 30.66,39.85 30.66,37.72 30.66,30.25 v29.59,29.18
N$32  (via drill 0.3)
  Top 0.152: v8.94,20.73 v8.94,16.05
  Bottom 0.152: ATMEGA328P.28 23.95,38.18 24.26,38.18 24.71,37.72 24.87,37.72 25.93,36.65 25.93,33.6 24.41,32.08 23.34,32.08 23.04,32.39 22.73,32.39 22.27,31.93 18.16,31.93 17.4,31.17 17.25,31.17 16.64,31.78 15.87,31.78 15.26,31.17 13.38,31.17 10.49,28.27 10.49,27.31 9.63,26.47 8.99,26.47 8.25,25.73 8.25,21.39 8.89,20.78 v8.94,20.73 | v8.94,16.05 8.94,15.9 I2C.3
N$33
  Top 0.152: PROG_ESP.1 15.32,57.27 RUN/FLASH.1
N$34  (via drill 0.3)
  Top 0.152: v19.68,31.01 19.68,31.93 v20.9,33.15 | v11.07,19.3 10.9,19.51 10.9,21.18 11.43,21.72 v11.43,22.45
  Bottom 0.152: v19.68,31.01 18.16,29.49 18.16,28.73 17.55,28.12 17.55,27.81 16.64,26.9 16.03,26.9 15.11,25.98 15.11,24.92 13.59,23.39 12.37,23.39 v11.43,22.45 | v20.9,33.15 23.34,35.59 23.8,35.59 ATMEGA328P.27 | v11.07,19.3 11.07,18.29 10.41,17.63 10.41,12.32 9.5,11.4 I2C.4
N$35
  Top 0.152: ATMEGA328P.25 23.8,30.71 23.04,30.71 21.82,31.93 21.82,36.04 17.55,40.31 15.26,40.31 13.74,41.83 11.91,41.83 11.15,41.07 9.78,41.07 9.63,41.22 5.36,41.22 4.29,42.29 3.22,42.29 GPIO1.2 0.38,39.49 0.38,13.49 1.4,12.47 SENSOR1.2
N$36  (via drill 0.3)
  Top 0.152: 31.42,78.56 +R1.1
  Top 0.305: v34.47,77.65 33.55,78.56 31.42,78.56
  Bottom 0.305: v34.47,77.65 38.43,73.69 45.13,73.69 47.12,71.7 47.12,68.96 47.88,68.2 47.88,48.84 43,43.97 43,43.66 SERIES/PARALLEL.3
N$37
  Top 0.152: 40.26,40.92 SERIES/PARALLEL.6 | 31.42,5.41 -R.1 | 40.87,29.81 BARREL_JACK.RING_SW
  Top 0.305: 31.42,5.41 33.4,5.41 35.03,3.78 35.58,3.28 38.58,3.28 41.32,6.02 41.32,15.39 42.9,16.97 42.93,19.41 42.93,19.43 44.37,20.88 45.54,20.88 47.07,22.4 47.07,26.87 45.29,28.65 45.29,28.93 | 40.26,40.92 40.26,30.19 BARREL_JACK.RING_SW 41.72,28.73 45.08,28.73 45.29,28.93 | 43,33.5 45.29,31.22 45.29,28.93
  Top 0.406: VIN.2 43,33.5
N$38
  Top 0.152: 43,40.92 SERIES/PARALLEL.4 | 11.3,5.41 -L.1
  Top 0.305: 43,40.92 43,40.61 47.9,35.71 47.9,10.77 44.22,7.09 43.2,7.09 40.41,4.29 40.41,1.45 39.39,0.43 34.72,0.43 32.03,3.12 15.57,3.12 13.28,5.41 11.3,5.41
N$39
  Top 0.152: 45.44,43.51 SERIES/PARALLEL.1
  Top 0.305: SERIES/PARALLEL.2 45.44,41.83 45.13,42.14 45.13,43.21 45.44,43.51
N$40  (via drill 0.3)
  Top 0.152: ATMEGA328P.11 16.33,12.88 16.33,13.79 15.11,15.01 15.11,15.32 13.44,16.99 12.52,16.99 10.34,19.18 10.34,22.76 9.24,23.85 9.22,23.85 v4.16,23.88
  Bottom 0.152: HC-SR04.3 2.23,27.97 3.94,26.16 3.94,24.1 v4.16,23.88
N$41
  Top 0.152: HC-SR04.2 2.31,30.56 2.31,30.86 3.99,32.54 3.99,33.15 4.75,33.91 4.75,34.21 4.29,34.67 4.29,38.02 5.05,38.79 5.05,39.09 4.75,39.4 4.75,40.31 5.36,40.92 6.12,40.92 7.19,39.85 7.19,39.09 14.35,31.93 14.65,31.93 15.26,31.32 15.42,31.32 16.18,32.08 16.79,32.08 17.09,32.39 17.55,32.39 20.9,29.03 22.27,29.03 23.19,28.12 23.8,28.12 ATMEGA328P.24
N$42  (via drill 0.3)
  Top 0.152: v33.1,8.61 25.32,8.61 24.56,7.85 23.95,7.85 ATMEGA328P.16
  Bottom 0.152: v33.1,8.61 35.08,10.59 35.08,15.62 34.16,16.54 34.16,17.91 SPI.1

### Text on the board
tPlace: +VIN | GND | U1V11F3 | GND | +5v | TX | RXD | RX | ESP8266-01 | TXD | U1V11F3 | RST | if no LDO on board | 5v | jumper pins 2&3 | 3v3 | see application | notes | BATT | SERIES | PARA | + | - | 5v | BARREL JACK | CE/SS | SCK | MOSI | MISO | 3v3 | GND | +5v | GND | PD3 | SCL | +5v | SDA | 3v3 | -VIN | VER 2.0 | SENSOR PLATFORM + GPIO
bPlace: SENSOR PLATFORM + GPIO | Supply Voltage: | see application notes | VER 2.0 | Jan 2016 | GPIO2 | PC2 | 3v3 | PB6 | +5v | PB7 | GND | GPIO1 | PC3 | PD4 | ESP | IO2 | +5v | PC1 | 3v3 | PD5 | PB0 | NC | GND | GND | +5V | PC2 | GND